# Altium schematic sheet _PCB_2L - Interface.SchDoc
size A4; DocumentNumber: 2; SheetNumber: 2; SheetTotal: 2
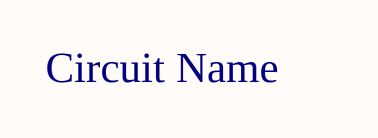
[diagram p0: _PCB_2L - Interface.SchDoc]

## Notes on the sheet
- Circuit Name
- Project:
- ***
- Title:
- Engineer:
- Project Code:
- LOGO
- Date:
- Revision:
- Sheet
- of
- Size:
- A4